# EAGLE design bb-psu-mk-1.0 (EAGLE 6.5.0)
VERSION: 1.0
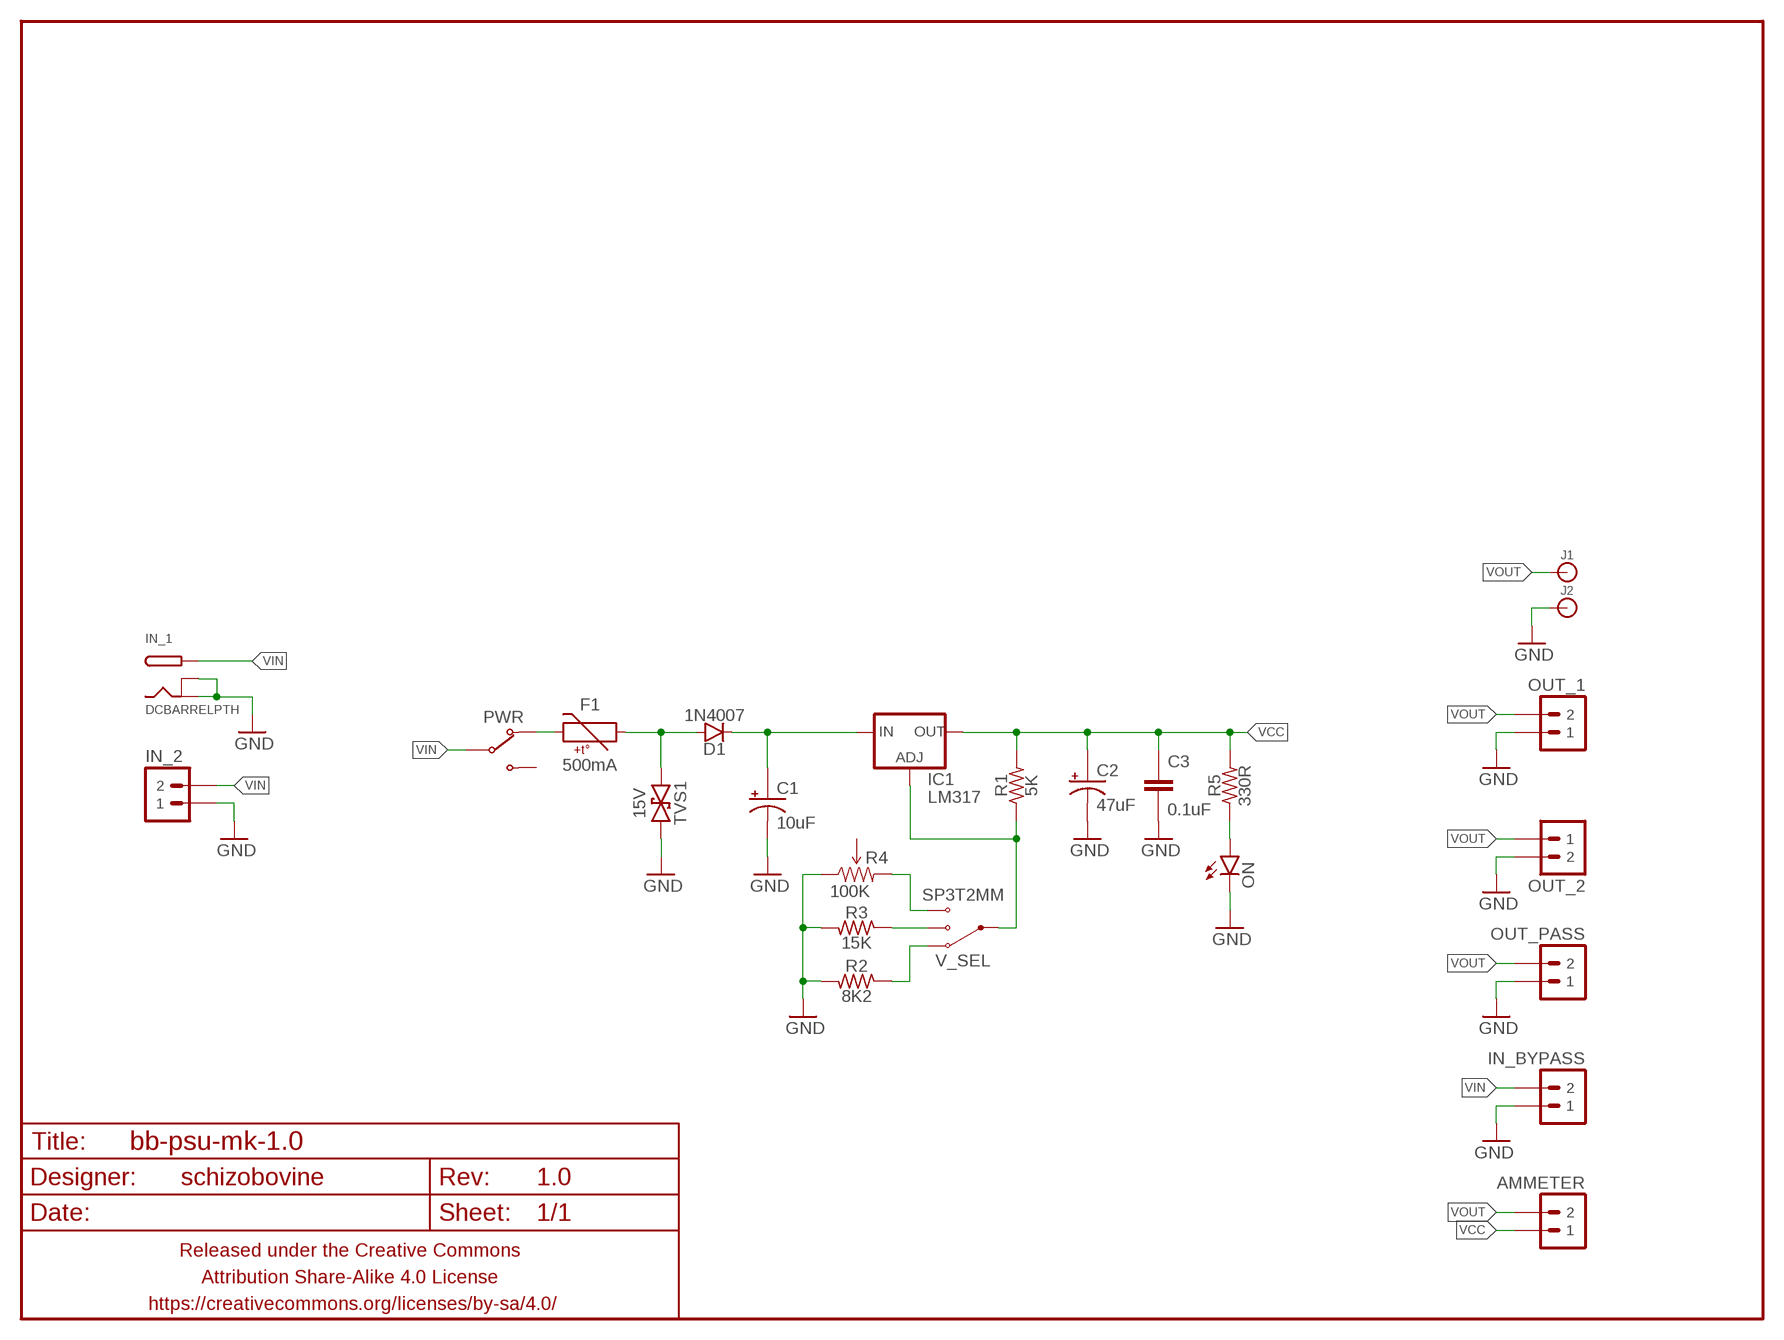
[diagram p0: schematic, sheet 1]

## Parts
AMMETER  M02PTH-CENTERED  [1X02-CENTER]
C1  10uF  CAPACITOR-POLARIZEDE2.5-6  [E2,5-6]
C2  47uF  CAPACITOR-POLARIZEDE2.5-6  [E2,5-6]
C3  0.1uF  CAPACITOR-CERAMIC025-024X044  [C025-024X044]
D1  1N4007  DIODEPTH-10.68MM  [DIODE-10.16MM]
F1  500mA  PTCPTH-5.08MM  [PTC-PTH-5.08MM]
FRAME1  FRAME-LETTERNO_PACKAGE  [DUMMY]
IC1  LM317  V_REG_317THERMPAD  [TO220-THERMPAD]
IN_1  DCBARRELPTH  [DCJACK_2MM_PTH]
IN_2  M02PTH-CENTERED-R+  [1X02-CENTER-R+]
IN_BYPASS  M02PTH-CENTERED-R+  [1X02-CENTER-R+]
J1  BANANA_CONNPOAST  [BINDING_POST]
J2  BANANA_CONNPOAST  [BINDING_POST]
ON  LED3MM-LESS  [LED3MM-LESSSILK]
OUT_1  M02PTH-CENTERED-R+  [1X02-CENTER-R+]
OUT_2  M023.5MM  [SCREWTERMINAL-3.5MM-2]
OUT_PASS  M02PTH-CENTERED-R+  [1X02-CENTER-R+]
PWR  SWITCH-SPDTPTH-RA-2.54MM  [SPDT-RA-2.54MM]
R1  5K  RESISTORPTH-AXIAL-6.35MM  [RESISTOR-AXIAL-PTH-6.35MM]
R2  8K2  RESISTORPTH-AXIAL-6.35MM  [RESISTOR-AXIAL-PTH-6.35MM]
R3  15K  RESISTORPTH-AXIAL-6.35MM  [RESISTOR-AXIAL-PTH-6.35MM]
R4  100K  TRIMPOT-PTH-KNOB  [3386U]
R5  330R  RESISTORPTH-AXIAL-6.35MM  [RESISTOR-AXIAL-PTH-6.35MM]
TVS1  15V  TVSDO-41-10.16MM  [DO-41-TVS-BI-10.16MM]
V_SEL  SP3T2MM  [SP3T-2MM]

## Nets
GND: C1.- C2.- C3.2 IN_1.BRK IN_1.GND IN_2.1 IN_BYPASS.1 J2.P$1 ON.K(C) OUT_1.1 OUT_2.2 OUT_PASS.1 R2.P$2 R3.P$2 R4.1(CCW) TVS1.P$2
N$1: D1.A F1.P$1 TVS1.P$1
N$2: C1.+ D1.C IC1.3(IN)
N$3: F1.P$2 PWR.1(NC)
N$4: ON.A R5.P$1
N$6: IC1.1(ADJ) R1.P$1 V_SEL.P$1(COM)
N$7: R3.P$1 V_SEL.P$3(B)
N$8: R4.3(CW) V_SEL.P$4(C)
N$10: R2.P$1 V_SEL.P$2(A)
VCC: AMMETER.1 C2.+ C3.1 IC1.2@1(OUT) IC1.2@2(OUT) R1.P$2 R5.P$2
VIN: IN_1.PWR IN_2.2 IN_BYPASS.2 PWR.2(COM)
VOUT: AMMETER.2 J1.P$1 OUT_1.2 OUT_2.1 OUT_PASS.2
Unconnected: PWR.3(NO) R4.2(WIPER)

## Library data of the parts
AMMETER IN_2 IN_BYPASS OUT_1 OUT_2 OUT_PASS = A_butts:M02: Standard 2-pin 0.1" header. Use with - straight break away headers ( PRT-00116) - right angle break away headers (PRT-00553) - swiss pins (PRT-00743) - machine pins (PRT-00117) - female headers (PRT-00115) Molex polarized connector foot print use with: PRT-08233 with associated crimp pins and housings. 2.54_SCREWTERM for use with PRT-10571. 3.5mm Screw Terminal footprints for PRT-08084 5mm Screw Terminal footprints for use with PRT-08433
C1 C2 = A_butts:CAPACITOR-POLARIZED: POLARIZED CAPACITOR, American symbol
C3 = A_butts:CAPACITOR-CERAMIC: CAPACITOR, European symbol
D1 = A_butts:DIODE: Diode These are standard reverse protection diodes and small signal diodes. SMA package can handle up to about 1A. SOD-323 can handle about 200mA. What the SOD-323 package when ordering, there are some mfgs out there that are 5-pin packages.
F1 = A_butts:PTC: Resettable Fuse PTC Resettable Fuse. Spark Fun Electronics SKU : COM-08357
FRAME1 = A_butts:FRAME-LETTER: Schematic Frame Standard 8.5x11 US Letter frame; DESIGNER: schizobovine; VERSION: 1.0
IC1 = A_butts:V_REG_317: Voltage Regulator Standard LM317 adjustable voltage regulator. AOI (Adjust Output Input). Google 'LM317 Calculator' for easy to use app to get the two resistor values needed. 240/720 for 5V output. 240/390 for 3.3V output. Spark Fun Electronics SKU : COM-00527
IN_1 = A_butts:DCBARREL: 2.0mm DC Barrel Jack DCJACK_2MM_PTH - Through Hole Jack (4UConnector: 05537)
J1 J2 = A_butts:BANANA_CONN: Through-hole banana jack
ON = A_butts:LED: LEDs Standard schematic elements and footprints for 5mm, 3mm, 1206, and 0603 sized LEDs. 5mm - Spark Fun Electronics SKU : COM-00529 (and others)
PWR = A_butts:SWITCH-SPDT
R1-R3 R5 = A_butts:RESISTOR: RESISTOR, American symbol
R4 = A_butts:TRIMPOT: Various small potentiometers for "set-and-forget" applications
TVS1 = A_butts:TVS: Transient voltage suppressor- prevents ESD on inputs. Ignore package description- MBRA140 is NOT this type of part!!!
V_SEL = A_butts:SP3T

## Board
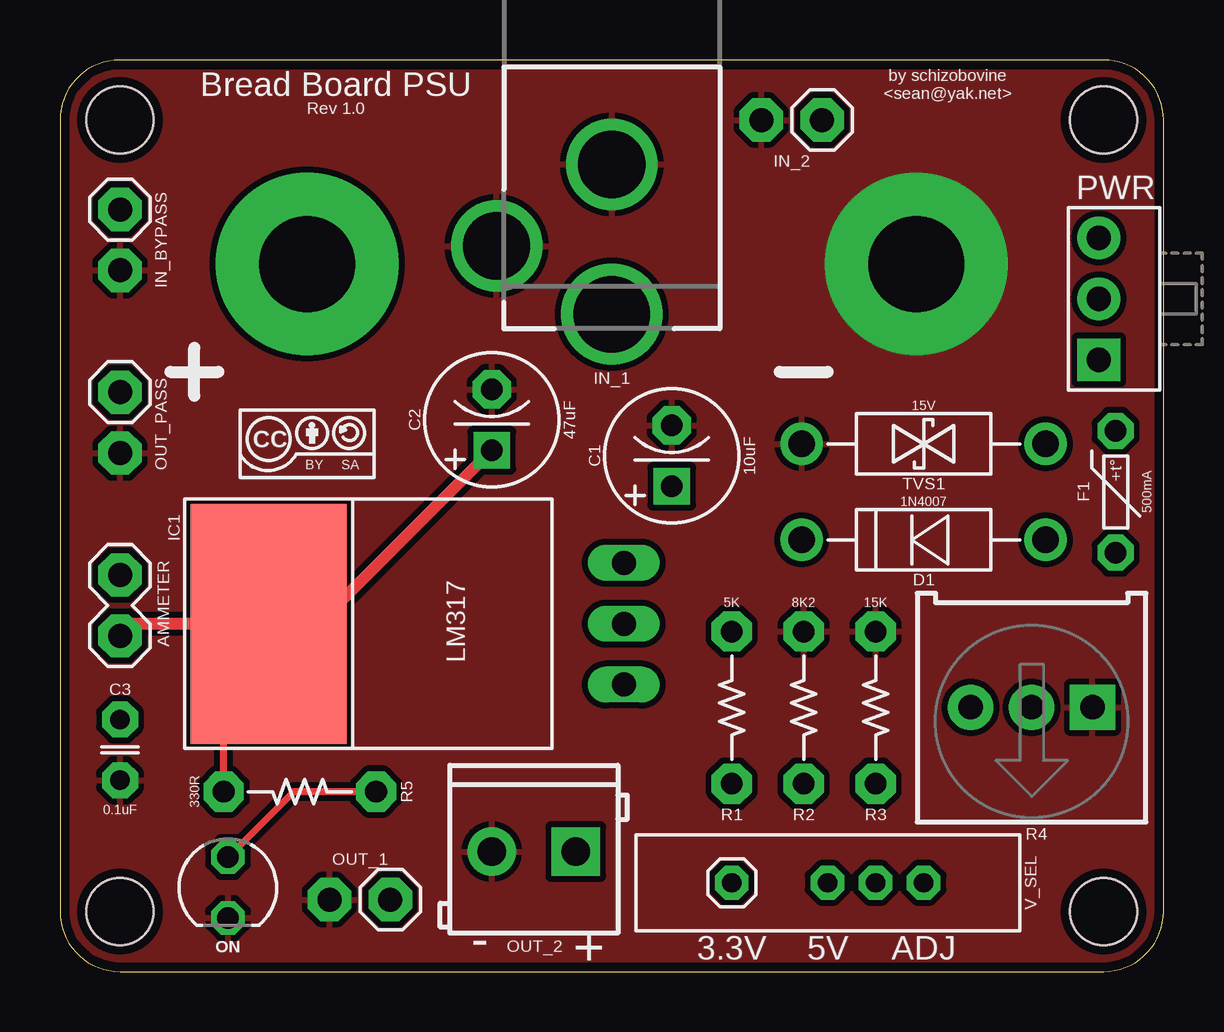
[diagram p1: board, top side]
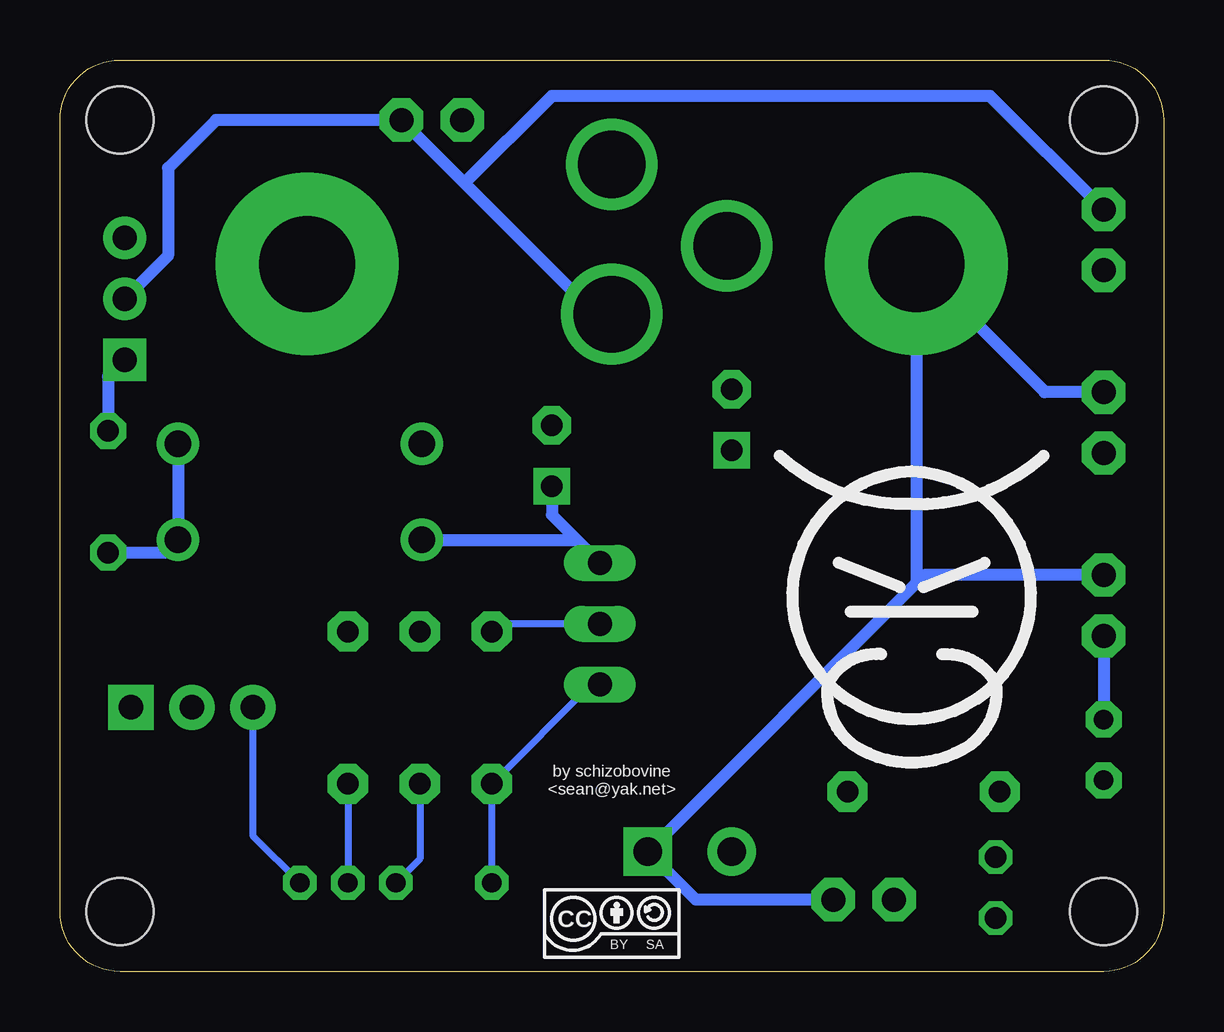
[diagram p2: board, bottom side, seen from below]

Size 46 x 38 mm. Coordinates in mm from the lower left corner, seen from the top.
Outline: 0,35.5 0,2.5 arc90 2.5,0 43.5,0 arc90 46,2.5 46,35.5 arc90 43.5,38 2.5,38 arc90 0,35.5
Copper layers (1*16): Top 0.0356mm / dielectric 1.5011mm / Bottom 0.0356mm
Design rules "LaenPCBOrder2": minimum track width 6mil, minimum drill 13mil, track to track 6mil, track to pad 6mil, pad to pad 6mil, via to via 6mil, smd to smd 6mil, copper to edge 15mil, drill to drill 6mil, minimum pad ring 7mil, minimum via ring 7mil, stop-mask expansion 3mil, vias tented up to drill 20mil, thermal gap 10mil
Holes 2.8 mm at 2.5,35.5 2.5,2.5 43.5,2.5 43.5,35.5

### Footprints (pad centres in the part's own frame; a part is rotated, then mirrored left to right if it is on the bottom)
1X02-CENTER = drill 1 pad 1.8 octagon: 1 -1.27,0; 2 1.27,0
E2,5-6 = drill 0.9 pad 1.524 square: + -1.27,0 | drill 0.9 pad 1.6 octagon: - 1.27,0
C025-024X044 = drill 0.813 pad 1.5 octagon: 1 -1.27,0; 2 1.27,0
DIODE-10.16MM = drill 1.1 pad 1.778: A -5.08,0; C 5.08,0
PTC-PTH-5.08MM = drill 0.9 pad 1.5 octagon: P$1 -2.54,0; P$2 2.54,0
TO220-THERMPAD = drill 1 long: 1 -2.54,0; 2@2 0,0; 3 2.54,0 | smd 10 x 6.5: 2@1 0,14.81
DCJACK_2MM_PTH = drill 2.8: BRK -4.8,2.85; GND 0,6.25 | drill 3.2: PWR 0,0
1X02-CENTER-R+ = drill 1 pad 1.8 octagon: 1 -1.27,0; 2 1.27,0
BINDING_POST = drill 4 pad 7.62: P$1 0,0
LED3MM-LESSSILK = drill 0.9 pad 1.4 octagon: A -1.27,0; K 1.27,0
SCREWTERMINAL-3.5MM-2 = drill 1.2 pad 2.032 square: 1 0,0 | drill 1.2 pad 2.032: 2 3.5,0
SPDT-RA-2.54MM = drill 1.016 pad 1.778 square: 1 0,0 | drill 1.016 pad 1.778: 2 2.54,0; 3 5.08,0
RESISTOR-AXIAL-PTH-6.35MM = drill 0.9 pad 1.676 octagon: P$1 -3.175,0; P$2 3.175,0
3386U = drill 1.016 pad 1.88 square: 1 -2.54,-0.015 | drill 1.016 pad 1.88: 2 0,-0.015; 3 2.54,-0.015
DO-41-TVS-BI-10.16MM = drill 1.1 pad 1.778: P$1 -5.08,0; P$2 5.08,0
SP3T-2MM = drill 0.8 pad 1.4 octagon: P$1 -4,0; P$2 0,0; P$3 2,0; P$4 4,0

### Placement (x,y rotation side)
AMMETER  2.5,15.26 90 top
C1  25.5,21.5 90 top
C2  18,23 90 top
C3  2.5,9.24 270 top
D1  36,18 180 top
F1  44,20 90 top
FRAME1  0,0 0 top
IC1  23.5,14.5 90 top
IN_1  23,27.4 0 top
IN_2  30.5,35.5 0 top
IN_BYPASS  2.5,30.5 90 top
J1  10.3,29.5 0 top
J2  35.7,29.5 0 top
ON  7,3.5 270 top
OUT_1  12.5,3 0 top
OUT_2  21.5,5 180 top
OUT_PASS  2.5,22.88 90 top
PWR  43.3,25.5 90 top
R1  28,11 90 top
R2  31,11 90 top
R3  34,11 90 top
R4  40.5,11 180 top
R5  10,7.5 180 top
TVS1  36,22 180 top
U$1  [CC-BY-SA-4.0-NO-URL]  23,2 0 bottom
U$2  [CC-BY-SA-4.0-NO-URL]  10.3,22 0 top
U$3  [COW]  10.5,14.5 0 bottom
V_SEL  32,3.7 0 top

### Tracks (layer width: path | path; a pad name or v marks a point on that pad's centre or on a via)
GND
  pour Top (isolate 0.25): 46,35.5 46,2.5 arc-90 43.5,0 2.5,0 arc-90 0,2.5 0,35.5 arc-90 2.5,38 43.5,38 arc-90
N$1
  Bottom 0.5: TVS1.P$1 D1.A 41.62,17.46 F1.P$1
N$2
  Bottom 0.3: 24.46,18 IC1.3
  Bottom 0.5: D1.C 24.46,18 | C1.+ 25.5,19.04 IC1.3
N$3
  Bottom 0.5: PWR.1 44,24.8 F1.P$2
N$4
  Top 0.3: R5.P$1 9.73,7.5 ON.A
N$6
  Bottom 0.3: IC1.1 23.86,11.96 R1.P$1 V_SEL.P$1
N$7
  Bottom 0.3: R3.P$1 V_SEL.P$3
N$8
  Bottom 0.3: R4.3 37.96,5.66 V_SEL.P$4
N$10
  Bottom 0.3: R2.P$1 31,4.7 V_SEL.P$2
VCC
  Top 0.3: IC1.2@1 9,14.5 6.83,12.32 R5.P$2
  Top 0.5: IC1.2@1 3.01,14.5 AMMETER.1 | 9,14.5 10.77,14.5 C2.+
  Bottom 0.3: R1.P$2 27.68,14.5 IC1.2@2
  Bottom 0.5: AMMETER.1 C3.1
VIN
  Bottom 0.5: IN_BYPASS.2 7.23,36.5 25.5,36.5 29.14,32.87 | PWR.2 41.5,29.84 41.5,33.5 39.5,35.5 IN_2.2 29.14,32.87 | IN_1.PWR 23.67,27.4 29.14,32.87
VOUT
  Bottom 0.5: OUT_2.1 10.3,16.2 J1.P$1 4.95,24.15 OUT_PASS.2 | OUT_1.2 19.5,3 OUT_2.1 | AMMETER.2 9.97,16.53 OUT_2.1

### Text on the board
tPlace: Bread Board PSU | by schizobovine / <sean@yak.net> | 3.3V | 5V | ADJ | - | +
bPlace: by schizobovine / <sean@yak.net>